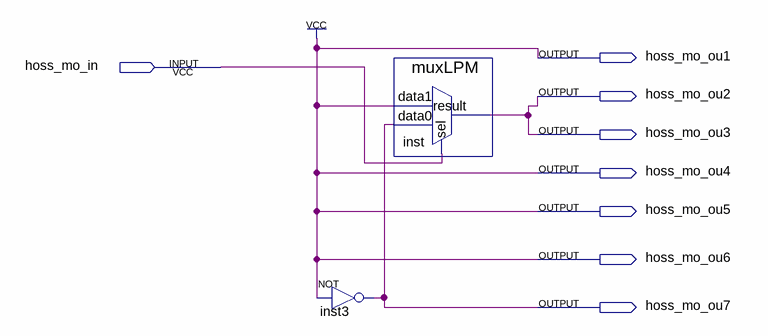
[diagram p0: schematic sheet]
// Quartus schematic binToDec.bdf as structural Verilog: 2 symbols, 8 pins
module binToDec (
  input  hoss_mo_in,
  output hoss_mo_ou1,
  output hoss_mo_ou2,
  output hoss_mo_ou3,
  output hoss_mo_ou4,
  output hoss_mo_ou5,
  output hoss_mo_ou6,
  output hoss_mo_ou7
);

  not inst3 (hoss_mo_ou7, 1'b1);
  muxLPM inst (.data1(1'b1), .data0(hoss_mo_ou7), .sel(hoss_mo_in), .result(hoss_mo_ou2));

  assign hoss_mo_ou1 = 1'b1;
  assign hoss_mo_ou3 = hoss_mo_ou2;
  assign hoss_mo_ou4 = 1'b1;
  assign hoss_mo_ou5 = 1'b1;
  assign hoss_mo_ou6 = 1'b1;
endmodule
